# EAGLE design Adafruit CAN Bus BFF (EAGLE 9.6.2)
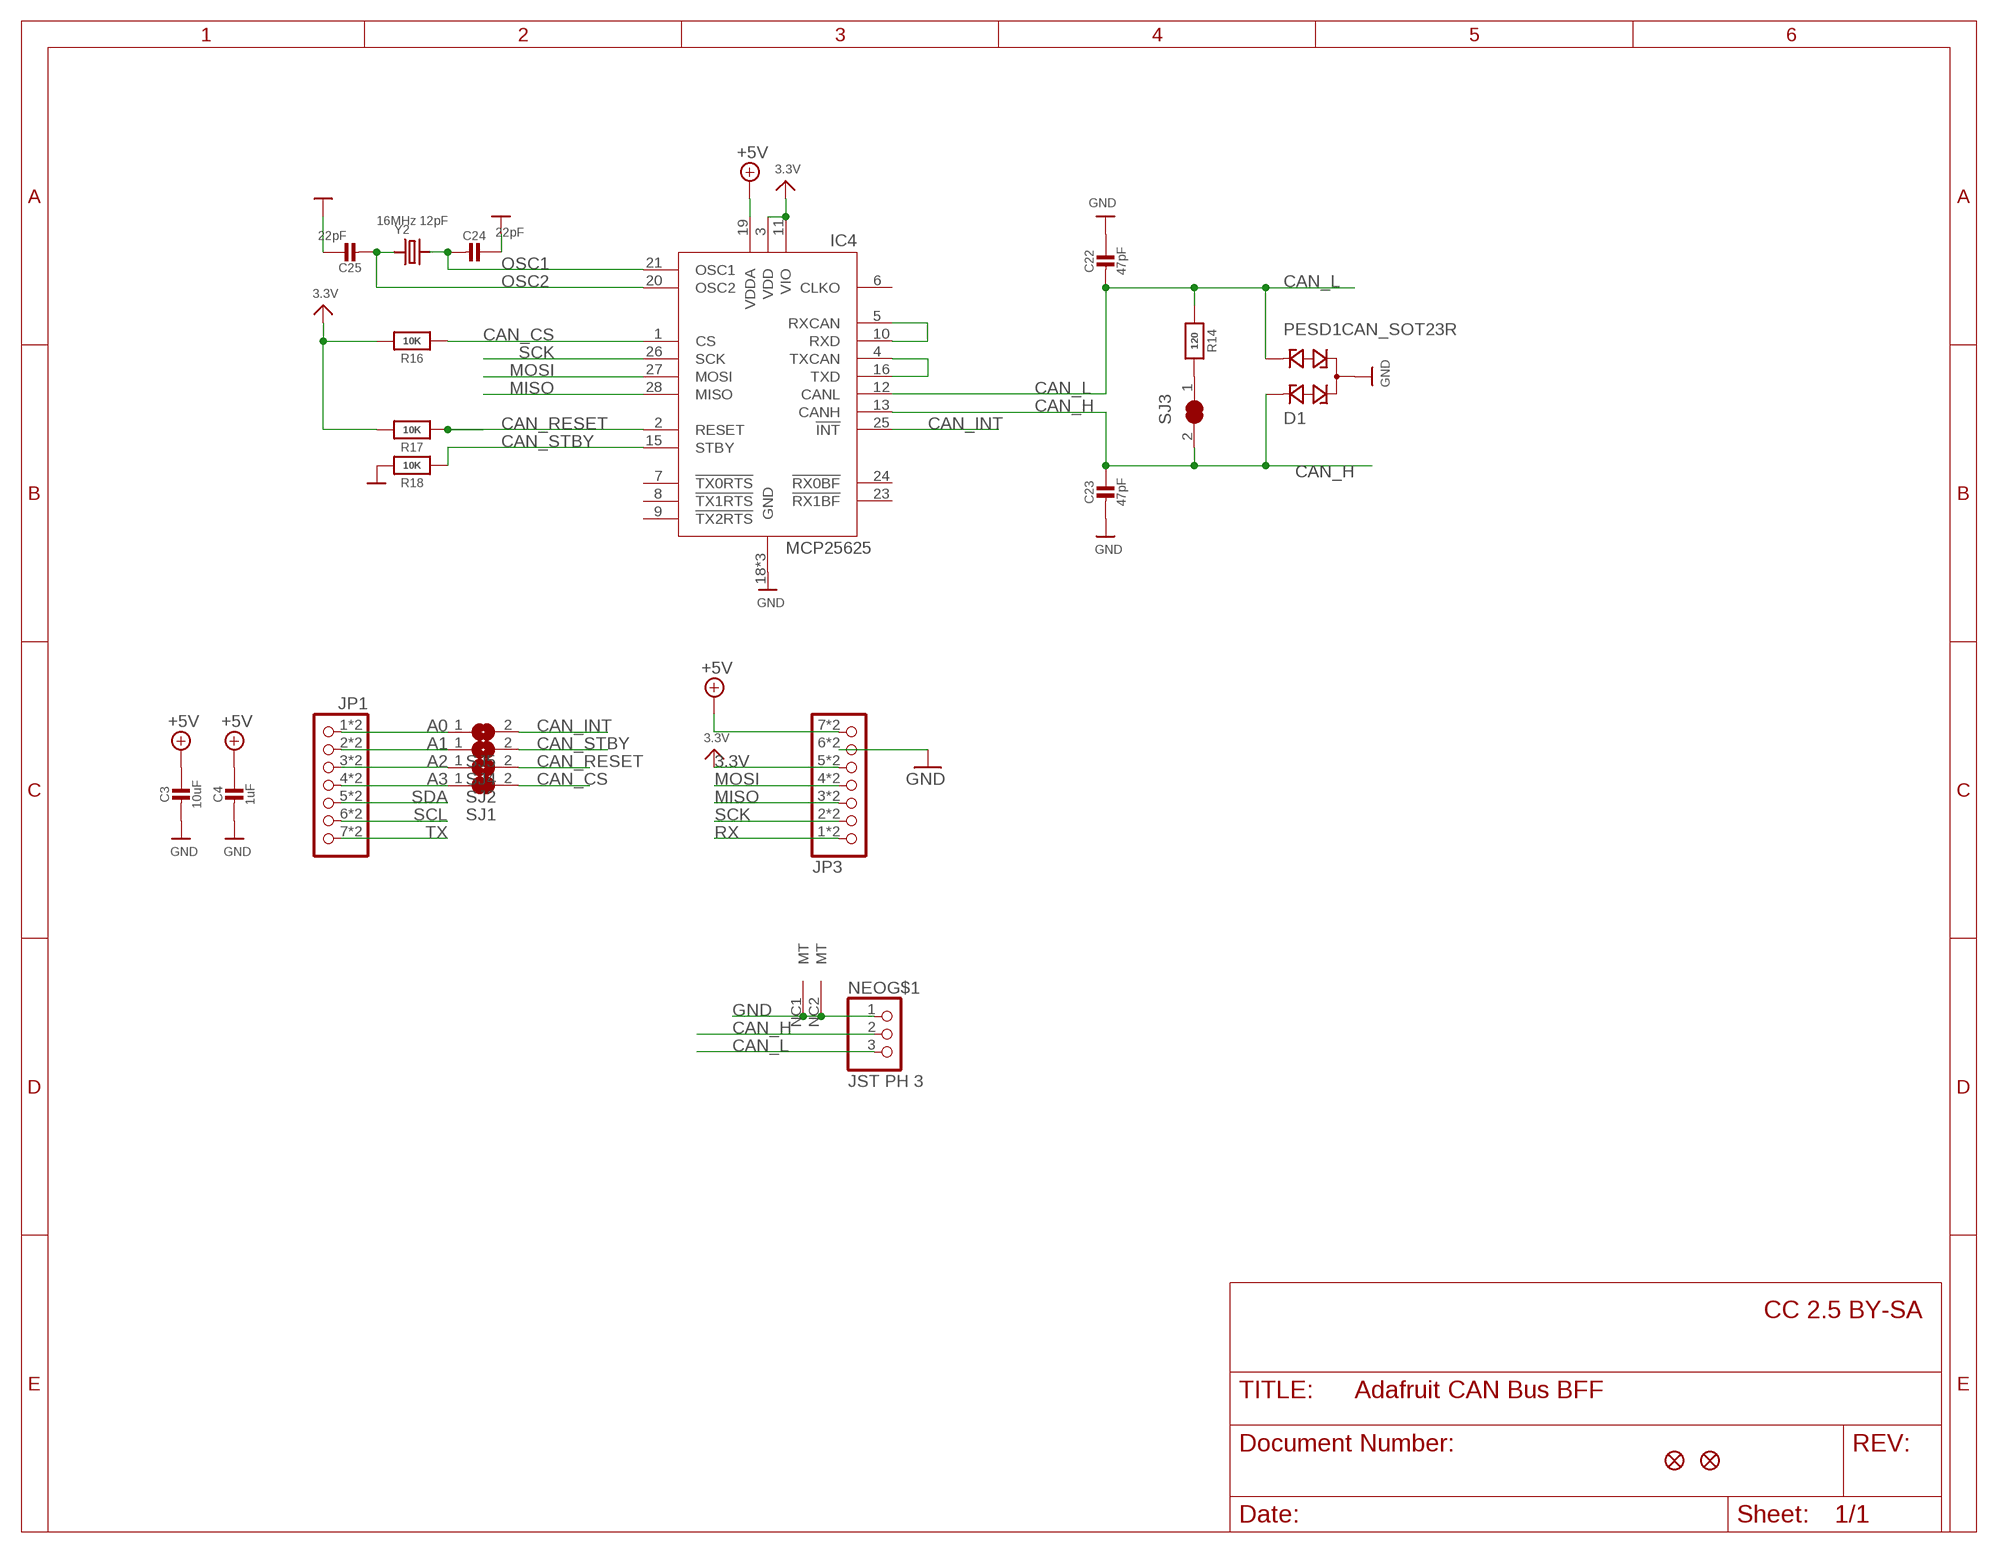
[diagram p0: schematic, sheet 1]

## Parts
C3  10uF  CAP_CERAMIC0805-NOOUTLINE  [0805-NO]
C4  1uF  CAP_CERAMIC0603_NO  [0603-NO]
C22  47pF  CAP_CERAMIC_0402NO  [_0402NO]
C23  47pF  CAP_CERAMIC_0402NO  [_0402NO]
C24  22pF  CAP_CERAMIC_0402NO  [_0402NO]
C25  22pF  CAP_CERAMIC_0402NO  [_0402NO]
D1  PESD1CAN_SOT23R  [SOT23-R]
IC4  MCP25625  [QFN28-ML_6X6MM]
JP1  HEADER-1X7_CASTEL  [1X07_CASTEL]
JP3  HEADER-1X7_CASTEL  [1X07_CASTEL]
NEO  JST PH 3  CON_JST_PH_3PIN  [JSTPH3]
R14  120  RESISTOR_0402NO  [_0402NO]
R16  10K  RESISTOR_0402NO  [_0402NO]
R17  10K  RESISTOR_0402NO  [_0402NO]
R18  10K  RESISTOR_0402NO  [_0402NO]
SJ1  SOLDERJUMPER_CLOSED  [SOLDERJUMPER_CLOSEDWIRE]
SJ2  SOLDERJUMPER  [SOLDERJUMPER_ARROW_NOPASTE]
SJ3  SOLDERJUMPER_CLOSED  [SOLDERJUMPER_CLOSEDWIRE]
SJ4  SOLDERJUMPER  [SOLDERJUMPER_ARROW_NOPASTE]
SJ5  SOLDERJUMPER  [SOLDERJUMPER_ARROW_NOPASTE]
U$6  FIDUCIAL_1MM  [FIDUCIAL_1MM]
U$8  FIDUCIAL_1MM  [FIDUCIAL_1MM]
Y2  16MHz 12pF  CRYSTAL2.5X2.0  [CRYSTAL_2.5X2]

## Nets
3.3V: IC4.3(VDD) IC4.11(VIO) JP3.5 JP3.5C R16.2 R17.2
+5V [power]: C3.1 C4.1 IC4.19(VDDA) JP3.7 JP3.7C
A0: JP1.1 JP1.1C SJ5.1
A1: JP1.2 JP1.2C SJ4.1
A2: JP1.3 JP1.3C SJ2.1
A3: JP1.4 JP1.4C SJ1.1
CAN_CS: IC4.1(CS) R16.1 SJ1.2
CAN_H: C23.1 D1.1 IC4.13(CANH) NEO.2 SJ3.2
CAN_INT: IC4.25(!INT) SJ5.2
CAN_L: C22.2 D1.2 IC4.12(CANL) NEO.3 R14.1
CAN_RESET: IC4.2(RESET) R17.1 SJ2.2
CAN_STBY: IC4.15(STBY) R18.1 SJ4.2
GND [power]: C3.2 C4.2 C22.1 C23.2 C24.1 C25.1 D1.3 IC4.18(GND) IC4.22(GND) IC4.EXP(GND) JP3.6 JP3.6C NEO.1 NEO.NC1(MT) NEO.NC2(MT) R18.2
MISO: IC4.28(MISO) JP3.3 JP3.3C
MOSI: IC4.27(MOSI) JP3.4 JP3.4C
N$10: R14.2 SJ3.1
N$11: IC4.5(RXCAN) IC4.10(RXD)
N$12: IC4.4(TXCAN) IC4.16(TXD)
OSC1: C24.2 IC4.21(OSC1) Y2.3
OSC2: C25.2 IC4.20(OSC2) Y2.1
RX: JP3.1 JP3.1C
SCK: IC4.26(SCK) JP3.2 JP3.2C
SCL: JP1.6 JP1.6C
SDA: JP1.5 JP1.5C
TX: JP1.7 JP1.7C
Unconnected: IC4.6(CLKO) IC4.7(!TX0RTS) IC4.8(!TX1RTS) IC4.9(!TX2RTS) IC4.23(!RX1BF) IC4.24(!RX0BF)

## Notes on the sheet
- CC 2.5 BY-SA

## Library data of the parts
C3 C4 C22-C25 = microbuilder:CAP_CERAMIC: Ceramic Capacitors For new designs, use the packages preceded by an '_' character since they are more reliable: The following footprints should be used on most boards: _0402 - Standard footprint for regular board layouts _0603 - Standard footprint for regular board layouts _0805 - Standard footprint for regular board layouts _1206 - Standard footprint for regular board layouts For extremely tight-pitch boards where space is at a premium, the following 'micro-pitch' footprints can be used (smaller pads, no silkscreen outline, etc.): _0402MP - Micro-pitch footprint for very dense/compact boards _0603MP - Micro-pitch footprint for very dense/compact boards _0805MP - Micro-pitch footprint for very dense/compact boards _1206MP - Micro-pitch footprint for very dense/compact boards
D1 = adafruit_power:PESD1CAN: CAN bus ESD protection diode Source: http://www.nxp.com/documents/data_sheet/PESD1CAN.pdf
IC4 = microbuilder:MCP25625
JP1 JP3 = adafruit_electromech:HEADER-1X7: PIN HEADER
NEO = adafruit_electromech:CON_JST_PH_3PIN
R14 R16-R18 = microbuilder:RESISTOR: Resistors For new designs, use the packages preceded by an '_' character since they are more reliable: The following footprints should be used on most boards: _0402 - Standard footprint for regular board layouts _0603 - Standard footprint for regular board layouts _0805 - Standard footprint for regular board layouts _1206 - Standard footprint for regular board layouts For extremely tight-pitch boards where space is at a premium, the following 'micro-pitch' footprints can be used (smaller pads, no silkscreen outline, etc.): _0402MP - Micro-pitch footprint for very dense/compact boards _0603MP - Micro-pitch footprint for very dense/compact boards _0805MP - Micro-pitch footprint for very dense/compact boards _1206MP - Micro-pitch footprint for very dense/compact boards
SJ1 SJ3 = microbuilder:SOLDERJUMPER_CLOSED: Solder Jumper - Closed These solder jumpers are closed by default CLOSEDWIRE - 10 mil trace between pads that can be cut and resoldered later CLOSEDPERM - 63 mil trace between pads for a permanent connection (used to 'bridge' two signals, a shameless hack for Eagle). Can double as a test point as well (no cream layer)
SJ2 SJ4 SJ5 = microbuilder:SOLDERJUMPER: SMD Solder JUMPER Solder the two pads together to create a connection, or remove the solder to break it. REFLOW - Use this footprint for solder paste and reflow ovens. WAVE - Use this footprint for hand-soldering (larger pads). CLOSED - Has a trace between the two pads to ensure it is closed by default. The trace needs to be cut to disable the jumper, and can be closed again by creating a solder bridge between the two pads.; BOM: EXCLUDE
U$6 U$8 = microbuilder:FIDUCIAL: Fiducial Alignment Points Various fiducial points for machine vision alignment.; BOM: EXCLUDE
Y2 = microbuilder:CRYSTAL: Crystals HC49UP - Surface Mount Crystal 4.0MHz 18pF +/-30ppm Surface Mount Crystal [Digikey: 535-9857-1-ND] 12.0 MHz Surface Mount Crystal [Digikey: 535-9869-6-ND] 25.0 MHz Surface Mount Crystal [Digikey: 535-9078-1-ND] 2.5 x 2.0mm - MEMs SMT Crystal 16.0 MHz 10pF 20ppm 2.5 x 2.0mm Crystal [Digikey -40-85°C: 535-10923-1-ND] 3.2 x 2.5mm - MEMs SMT Crystal 12.0 MHz 8pF 15ppm 3.2 x 2.5mm Crystal [Digikey: -10-70°C: 644-1047-1-ND -40-125°C: 644-1128-1-ND] 40~85°C cheaper: 644-1173-6-ND 16.0 MHz 8pF 15ppm 3.2 x 2.5mm Crystal [Digikey: -10-70°C: 644-1049-1-ND -40-125°C: 644-1129-2-ND]-40~85°C cheaper: 644-1175-6-ND 16.0 MHz 10pF 10ppm 3.2 x 2.5mm Crystal [Digikey: 644-1100-1-ND] 27.12 MHz 18pF 30ppm 3.2 x 2.5mm Crystal [Digikey: 887-1424-1-ND] 27.12MHz 10pF 10ppm 3.2 x 2.5mm Crystal [Digikey: 887-1329-1-ND] 4.9 x 1.8mm - MEMs SMT Crystal 32.768 KHz 12.5pF 20ppm 4.9 x 1.8mm Crystal [Digikey: SE2415CT-ND] 8.0 x 3.8mm - Surface Mount Crystal 32.768kHz 12.5pF 20ppm -40°C-85°C [Digikey: 535-9166-2-ND] Cylinder 32.768KHz Cylinder Crystal (2x6mm body) [Ex. Digikey: 300-8341-2-ND]

## Net classes
1 power: width 0.305 mm
2 thickpower: width 0.406 mm

## Board
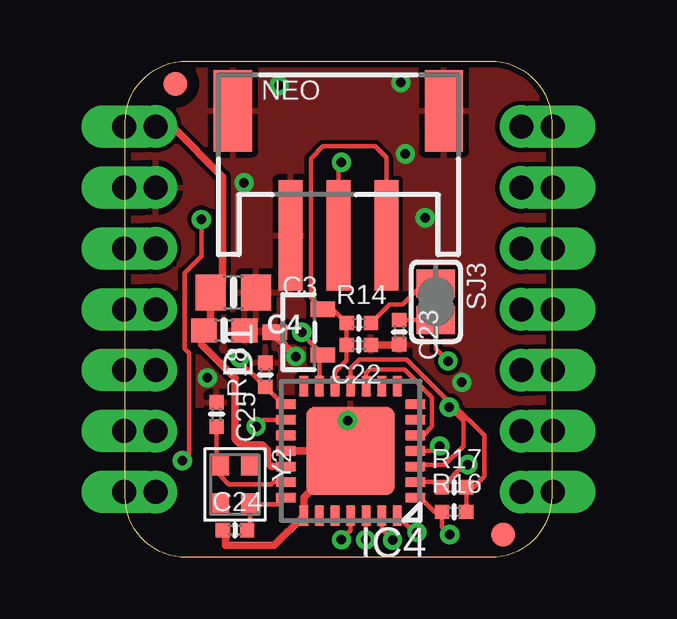
[diagram p1: board, top side]
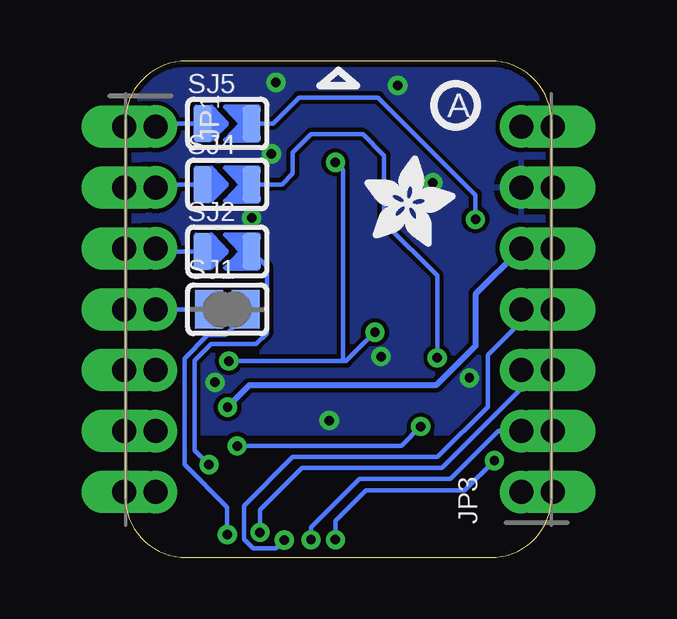
[diagram p2: board, bottom side, seen from below]

Size 17.78 x 20.7 mm. Coordinates in mm from the lower left corner, seen from the top.
Outline: 17.78,18.16 17.78,2.54 arc-90 15.24,0 2.54,0 arc-90 0,2.54 0,18.16 arc-90 2.54,20.7 15.24,20.7 arc-90 17.78,18.16
Copper layers (1*16): Top 0.035mm / dielectric 1.5mm / Bottom 0.035mm
Design rules "adafruit 7-7": minimum track width 7mil, minimum drill 15.5mil, track to track 7mil, track to pad 7mil, pad to pad 7mil, via to via 7mil, smd to smd 7mil, copper to edge 10mil, drill to drill 8mil, minimum pad ring 7mil, minimum via ring 8mil, stop-mask expansion 2mil, vias tented up to drill 20mil, thermal gap 10mil

### Footprints (pad centres in the part's own frame; a part is rotated, then mirrored left to right if it is on the bottom)
0805-NO = smd 1.24 x 1.5: 1 -0.95,0; 2 0.95,0
0603-NO = smd 1.075 x 1: 1 -0.85,0; 2 0.85,0
_0402NO = smd 0.6 x 0.6: 1 -0.508,0; 2 0.508,0
SOT23-R = smd 0.635 x 1.016: 1 -0.95,-1; 2 0.95,-1; 3 0,1
QFN28-ML_6X6MM = smd 0.85 x 0.4: 1 -2.7,1.95; 2 -2.7,1.3; 3 -2.7,0.65; 4 -2.7,0; 5 -2.7,-0.65; 6 -2.7,-1.3; 7 -2.7,-1.95; 15 2.7,-1.95; 16 2.7,-1.3; 17 2.7,-0.65; 18 2.7,0; 19 2.7,0.65; 20 2.7,1.3; 21 2.7,1.95 | smd 0.4 x 0.85: 8 -1.95,-2.7; 9 -1.3,-2.7; 10 -0.65,-2.7; 11 0,-2.7; 12 0.65,-2.7; 13 1.3,-2.7; 14 1.95,-2.7; 22 1.95,2.7; 23 1.3,2.7; 24 0.65,2.7; 25 0,2.7; 26 -0.65,2.7; 27 -1.3,2.7; 28 -1.95,2.7 | smd 3.7 x 3.7: EXP 0,0
1X07_CASTEL = drill 1 pad 1.778: 1 -7.62,0; 2 -5.08,0; 3 -2.54,0; 4 0,0; 5 2.54,0; 6 5.08,0; 7 7.62,0 | drill 1 pad 1.778 long: 1C -7.62,-1.324; 2C -5.08,-1.324; 3C -2.54,-1.324; 4C 0,-1.324; 5C 2.54,-1.324; 6C 5.08,-1.324; 7C 7.62,-1.324
JSTPH3 = smd 1 x 4.6: 1 -2,-2.7; 2 0,-2.7; 3 2,-2.7 | smd 1.6 x 3.4: NC1 -4.4,2.5; NC2 4.4,2.5
SOLDERJUMPER_CLOSEDWIRE = smd 1.168 x 1.6: 1 -0.762,0; 2 0.762,0 | smd 0.635 x 0.203: WIRE 0,0
SOLDERJUMPER_ARROW_NOPASTE = smd 0.762 x 1.524: 1 -1.016,0; 2 1.016,0
FIDUCIAL_1MM = smd 1 x 1: 1 0,0
CRYSTAL_2.5X2 = smd 0.9 x 0.75: 1 -0.825,-0.625; 2 0.825,-0.625; 3 0.825,0.625; 4 -0.825,0.625

### Placement (x,y rotation side)
C3  4.51,11.05 0 top
C4  4.13,9.46 0 top
C22  9.74,8.86 180 top
C23  11.43,9.4 270 top
C24  4.57,1.14 0 top
C25  3.81,5.97 270 top
D1  7.24,9.4 90 top
IC4  9.4,4.45 180 top
JP1  16.51,10.35 270 bottom
JP3  1.27,10.35 90 bottom
NEO  8.89,16.13 0 top
PLABEL1  [PLABEL1]  15.11,2.54 90 top
PLABEL2  [PLABEL2]  14.99,5.21 90 top
PLABEL3  [PLABEL3]  2.92,17.84 90 top
PLABEL4  [PLABEL4]  14.86,15.62 90 top
PLABEL5  [PLABEL5]  14.86,13.08 90 top
PLABEL6  [PLABEL6]  14.86,18.16 90 top
PLABEL7  [PLABEL7]  14.86,10.79 90 top
PLABEL8  [PLABEL8]  2.92,15.43 90 top
PLABEL9  [PLABEL9]  2.92,12.89 90 top
PLABEL11  [PLABEL11]  2.92,8 90 top
PLABEL12  [PLABEL12]  14.99,8.13 90 top
PLABEL13  [PLABEL13]  2.73,5.33 90 top
PLABEL14  [PLABEL14]  2.73,2.67 90 top
PLABEL19  [PLABEL19]  8.76,18.41 0 bottom
PLABEL20  [PLABEL20]  4.95,12.83 0 top
PLABEL21  [PLABEL21]  11.62,13.02 0 top
PLABEL22  [PLABEL22]  9.21,10.1 0 top
PLABEL23  [PLABEL23]  11.81,7.81 0 top
PLABEL24  [PLABEL24]  11.62,9.78 0 bottom
PLABEL25  [PLABEL25]  11.62,12.32 0 bottom
PLABEL26  [PLABEL26]  11.62,14.99 0 bottom
PLABEL27  [PLABEL27]  14.54,19.3 0 bottom
PLABEL28  [PLABEL28]  8.89,4.64 0 bottom
PLABEL29  [PLABEL29]  8.89,9.97 0 bottom
R14  9.74,9.78 0 top
R16  13.72,1.91 0 top
R17  13.72,2.93 0 top
R18  5.84,7.62 90 top
SJ1  13.53,10.35 0 bottom
SJ2  13.53,12.76 0 bottom
SJ3  12.95,10.67 270 top
SJ4  13.53,15.56 0 bottom
SJ5  13.53,18.1 0 bottom
U$3  [PCBFEAT-REV-040]  4,18.86 0 bottom
U$5  [ADAFRUIT_3.5MM]  7.81,12.95 0 bottom
U$6  15.76,0.95 0 top
U$8  2.1,19.75 0 top
Y2  4.57,3.05 270 top

### Tracks (layer width: path | path; a pad name or v marks a point on that pad's centre or on a via)
3.3V  (via drill 0.39)
  Top 0.178: IC4.11 9.4,7.87 9.78,8.26 11.72,8.26 13.51,6.46 v13.51,6.27 | IC4.3 12.16,3.86 13.32,3.86 14.1,4.64 14.1,5.69 v13.51,6.27 | R16.2 R17.2 14.54,2.93 14.99,3.38 14.99,5.08 13.65,6.41 v13.51,6.27
  Top 0.305: JP3.5C JP3.5
  Bottom 0.254: JP3.5 3.17,10.99 3.17,8.83 4.83,7.18 12.61,7.18 v13.51,6.27
+5V
  Top 0.305: IC4.19 6.11,3.79 5.94,3.96 5.94,4.47 5.71,4.7 4.83,4.7 4.57,4.95 4.57,7.49 3.18,8.89 3.18,9.36 | JP3.7C JP3.7 1.97,17.97 4.07,15.87 4.07,11.56 C3.1 3.56,9.87 3.18,9.49 3.18,9.36 | 3.18,9.36 C4.1
A0
  Top 0.305: JP1.1C JP1.1
  Bottom 0.178: JP1.1 16.38,18.1 SJ5.1
A1
  Top 0.305: JP1.2C JP1.2
  Bottom 0.178: JP1.2C 17.71,15.56 SJ4.1
A2
  Top 0.305: JP1.3C JP1.3
  Bottom 0.178: JP1.3 16.38,12.76 SJ2.1
A3
  Top 0.305: JP1.4C JP1.4
  Bottom 0.178: SJ1.1 JP1.4
CAN_CS  (via drill 0.39)
  Top 0.178: IC4.1 12.3,2.5 12.89,1.91 R16.1 13.21,1.27 v13.53,0.95
  Bottom 0.178: v13.53,0.95 13.53,2.1 15.3,3.87 15.3,8.31 14.34,9.27 13.59,9.27 12.76,10.1 SJ1.2
CAN_H  (via drill 0.39)
  Top 0.178: IC4.13 8.1,8.31 D1.1 7.37,9.32 v7.37,9.4 | C23.1 SJ3.2 12.95,8.7 v13.46,8.19 | NEO.2 8.89,16.35 v9.02,16.48
  Bottom 0.178: v9.02,16.48 8.7,16.16 8.7,8.19 v13.46,8.19 8.57,8.19 v7.37,9.4
CAN_INT  (via drill 0.39)
  Top 0.178: IC4.25 9.4,1.14 9.02,0.76 v9.02,0.74 | v2.39,4.04 2.67,4.32 2.67,8.53 2.47,8.72 2.47,11.87 3.17,12.57 v3.17,14.1
  Bottom 0.178: v9.02,0.74 9.02,1.52 7.75,2.79 3.63,2.79 v2.39,4.04 | v3.17,14.1 3.17,15.11 7.24,19.18 10.54,19.18 11.62,18.1 SJ5.2
CAN_L
  Top 0.178: IC4.12 8.75,7.73 9.23,8.22 C22.2 R14.1 8.66,10.35 D1.2 7.75,10.84 7.75,16.64 8.26,17.14 10.41,17.14 10.89,16.67 NEO.3
CAN_RESET  (via drill 0.39)
  Top 0.178: IC4.2 13,3.15 R17.1 14.15,3.87 v14.29,3.87
  Bottom 0.178: v14.29,3.87 14.88,4.47 14.88,8.22 14.21,8.9 12.32,8.9 11.87,9.35 11.87,12.13 SJ2.2
CAN_STBY  (via drill 0.39)
  Top 0.178: IC4.15 6.56,6.39 R18.1 4.77,8.18 v4.77,8.33
  Bottom 0.178: v4.77,8.33 4.77,11.76 6.99,13.97 6.99,16.76 7.87,17.65 10.03,17.65 10.79,16.89 10.79,16 11.24,15.56 SJ4.2
GND  (via drill 0.39)
  Top 0.305: JP3.6C JP3.6 | IC4.18 IC4.EXP | IC4.EXP 7.45,2.5 7.45,2.18 IC4.22 6.21,0.51 4.19,0.51 4.19,1.02 C24.1 | C23.2 11.4,8.87 C22.1 | D1.3 6.24,9.26 v7.11,8.38 | IC4.EXP 9.4,5.59 v9.27,5.71
  other vias: 3.43,7.49 4.95,15.62 11.68,16.83 14.03,7.3 12.51,14.16 6.41,19.68 11.49,19.81
  pour Top: 0,20.7 17.78,20.7 17.78,6.35 0,6.35
  pour Bottom: 0,20.7 17.78,20.7 17.78,5.21 0,5.21
MISO  (via drill 0.39)
  Top 0.178: v12.16,1.05 12.04,1.05 IC4.28
  Top 0.305: JP3.3C JP3.3
  Bottom 0.178: JP3.3 1.27,7.05 4.58,3.74 10.41,3.74 12.16,1.99 v12.16,1.05
MOSI  (via drill 0.39)
  Top 0.178: IC4.27 10.7,1.18 v11.15,0.73
  Top 0.305: JP3.4C JP3.4
  Bottom 0.178: v11.15,0.73 11.49,0.38 12.45,0.38 12.83,0.76 12.83,2.16 10.79,4.19 4.76,4.19 2.67,6.29 2.67,8.45 1.27,9.84 JP3.4
N$10
  Top 0.178: R14.2 11.01,10.54 11.56,10.54 12.45,11.43 SJ3.1
N$11
  Top 0.178: IC4.10 10.05,7.7 10.18,7.84 11.63,7.84 12.79,6.68 12.79,5.46 12.43,5.09 IC4.5
N$12  (via drill 0.39)
  Top 0.178: IC4.4 12.73,4.45 12.94,4.65 v13.11,4.65 | v5.46,5.46 5.75,5.75 IC4.16
  Bottom 0.178: v13.11,4.65 6.27,4.65 v5.46,5.46
OSC1
  Top 0.178: IC4.21 6.43,2.22 Y2.3 5.2,1.26 C24.2
OSC2
  Top 0.178: IC4.20 6.19,3.15 6.1,3.05 4.32,3.05 3.95,3.42 Y2.1 3.81,4.01 C25.2
RX
  Top 0.305: JP3.1C JP3.1
SCK  (via drill 0.39)
  Top 0.178: IC4.26 10.05,1.42 10.03,1.4 v10.03,0.74
  Top 0.305: JP3.2C JP3.2
  Bottom 0.178: v10.03,0.74 10.03,1.25 8,3.28 4.21,3.28 2.22,5.27 JP3.2
SCL
  Top 0.305: JP1.6C JP1.6
SDA
  Top 0.305: JP1.5C JP1.5
TX
  Top 0.305: JP1.7C JP1.7

### Text on the board
Pinguin_tBackup: 5V | A0 | A1 | G | 3V | G | S | L | A2 | - | A3 | MO | + | H | MI | Trm | SDA | SCK | SCL | RX | Sig | TX | NeoPixel BFF
Pinguin_bBackup: INT | USB | STBY | NeoPixel Driver / Neo+ <-> 5V / QT Py. Solder / back to back / Signal on A3 | RST | SPI Port / +CS min. | CS | MCP25625 / (MCP2515) / CAN BFF